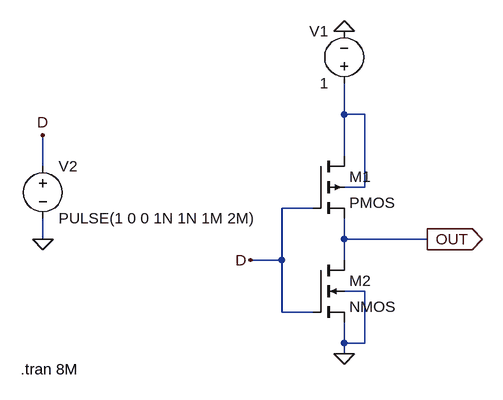
[diagram p0: schematic NOT_GATE_EXAMPLE.asc]
NOT_GATE_EXAMPLE.asc, the LTspice schematic file:
Version 4
SHEET 1 880 680
WIRE 80 -16 80 -64
WIRE 112 -16 80 -16
WIRE 80 48 80 -16
WIRE -384 64 -384 16
WIRE 112 96 112 -16
WIRE 112 96 80 96
WIRE 32 128 -16 128
WIRE -384 176 -384 144
WIRE 80 176 80 144
WIRE 208 176 80 176
WIRE -16 208 -16 128
WIRE -16 208 -64 208
WIRE 80 208 80 176
WIRE 112 256 80 256
WIRE -16 288 -16 208
WIRE 32 288 -16 288
WIRE 80 336 80 304
WIRE 112 336 112 256
WIRE 112 336 80 336
WIRE 80 352 80 336
FLAG 80 -144 0
FLAG 80 352 0
FLAG -64 208 D
FLAG -384 176 0
FLAG -384 16 D
FLAG 208 176 OUT
IOPIN 208 176 Out
SYMBOL pmos4 32 48 R0
SYMATTR InstName M1
SYMBOL nmos4 32 208 R0
SYMATTR InstName M2
SYMBOL voltage 80 -48 R180
WINDOW 0 24 96 Left 2
WINDOW 3 24 16 Left 2
WINDOW 123 0 0 Left 0
WINDOW 39 0 0 Left 0
SYMATTR InstName V1
SYMATTR Value 1
SYMBOL voltage -384 48 R0
WINDOW 123 0 0 Left 0
WINDOW 39 0 0 Left 0
SYMATTR InstName V2
SYMATTR Value PULSE(1 0 0 1N 1N 1M 2M)
TEXT -418 376 Left 2 !.tran 8M

The netlist it stands for:
* NOT_GATE_EXAMPLE.asc
M1 N001 D OUT N001 PMOS
M2 OUT D 0 0 NMOS
V1 N001 0 1
V2 D 0 PULSE(1 0 0 1N 1N 1M 2M)
.model NMOS NMOS
.model PMOS PMOS
.lib standard.mos
.tran 8M
.backanno
.end